# Altium schematic sheet Sheet1.SchDoc
size A3; SheetNumber: 1; SheetTotal: 1; SPICEModelCachePJYHEPLU: <root> / <DocumentId>PJYHEPLU</DocumentId> / </root>
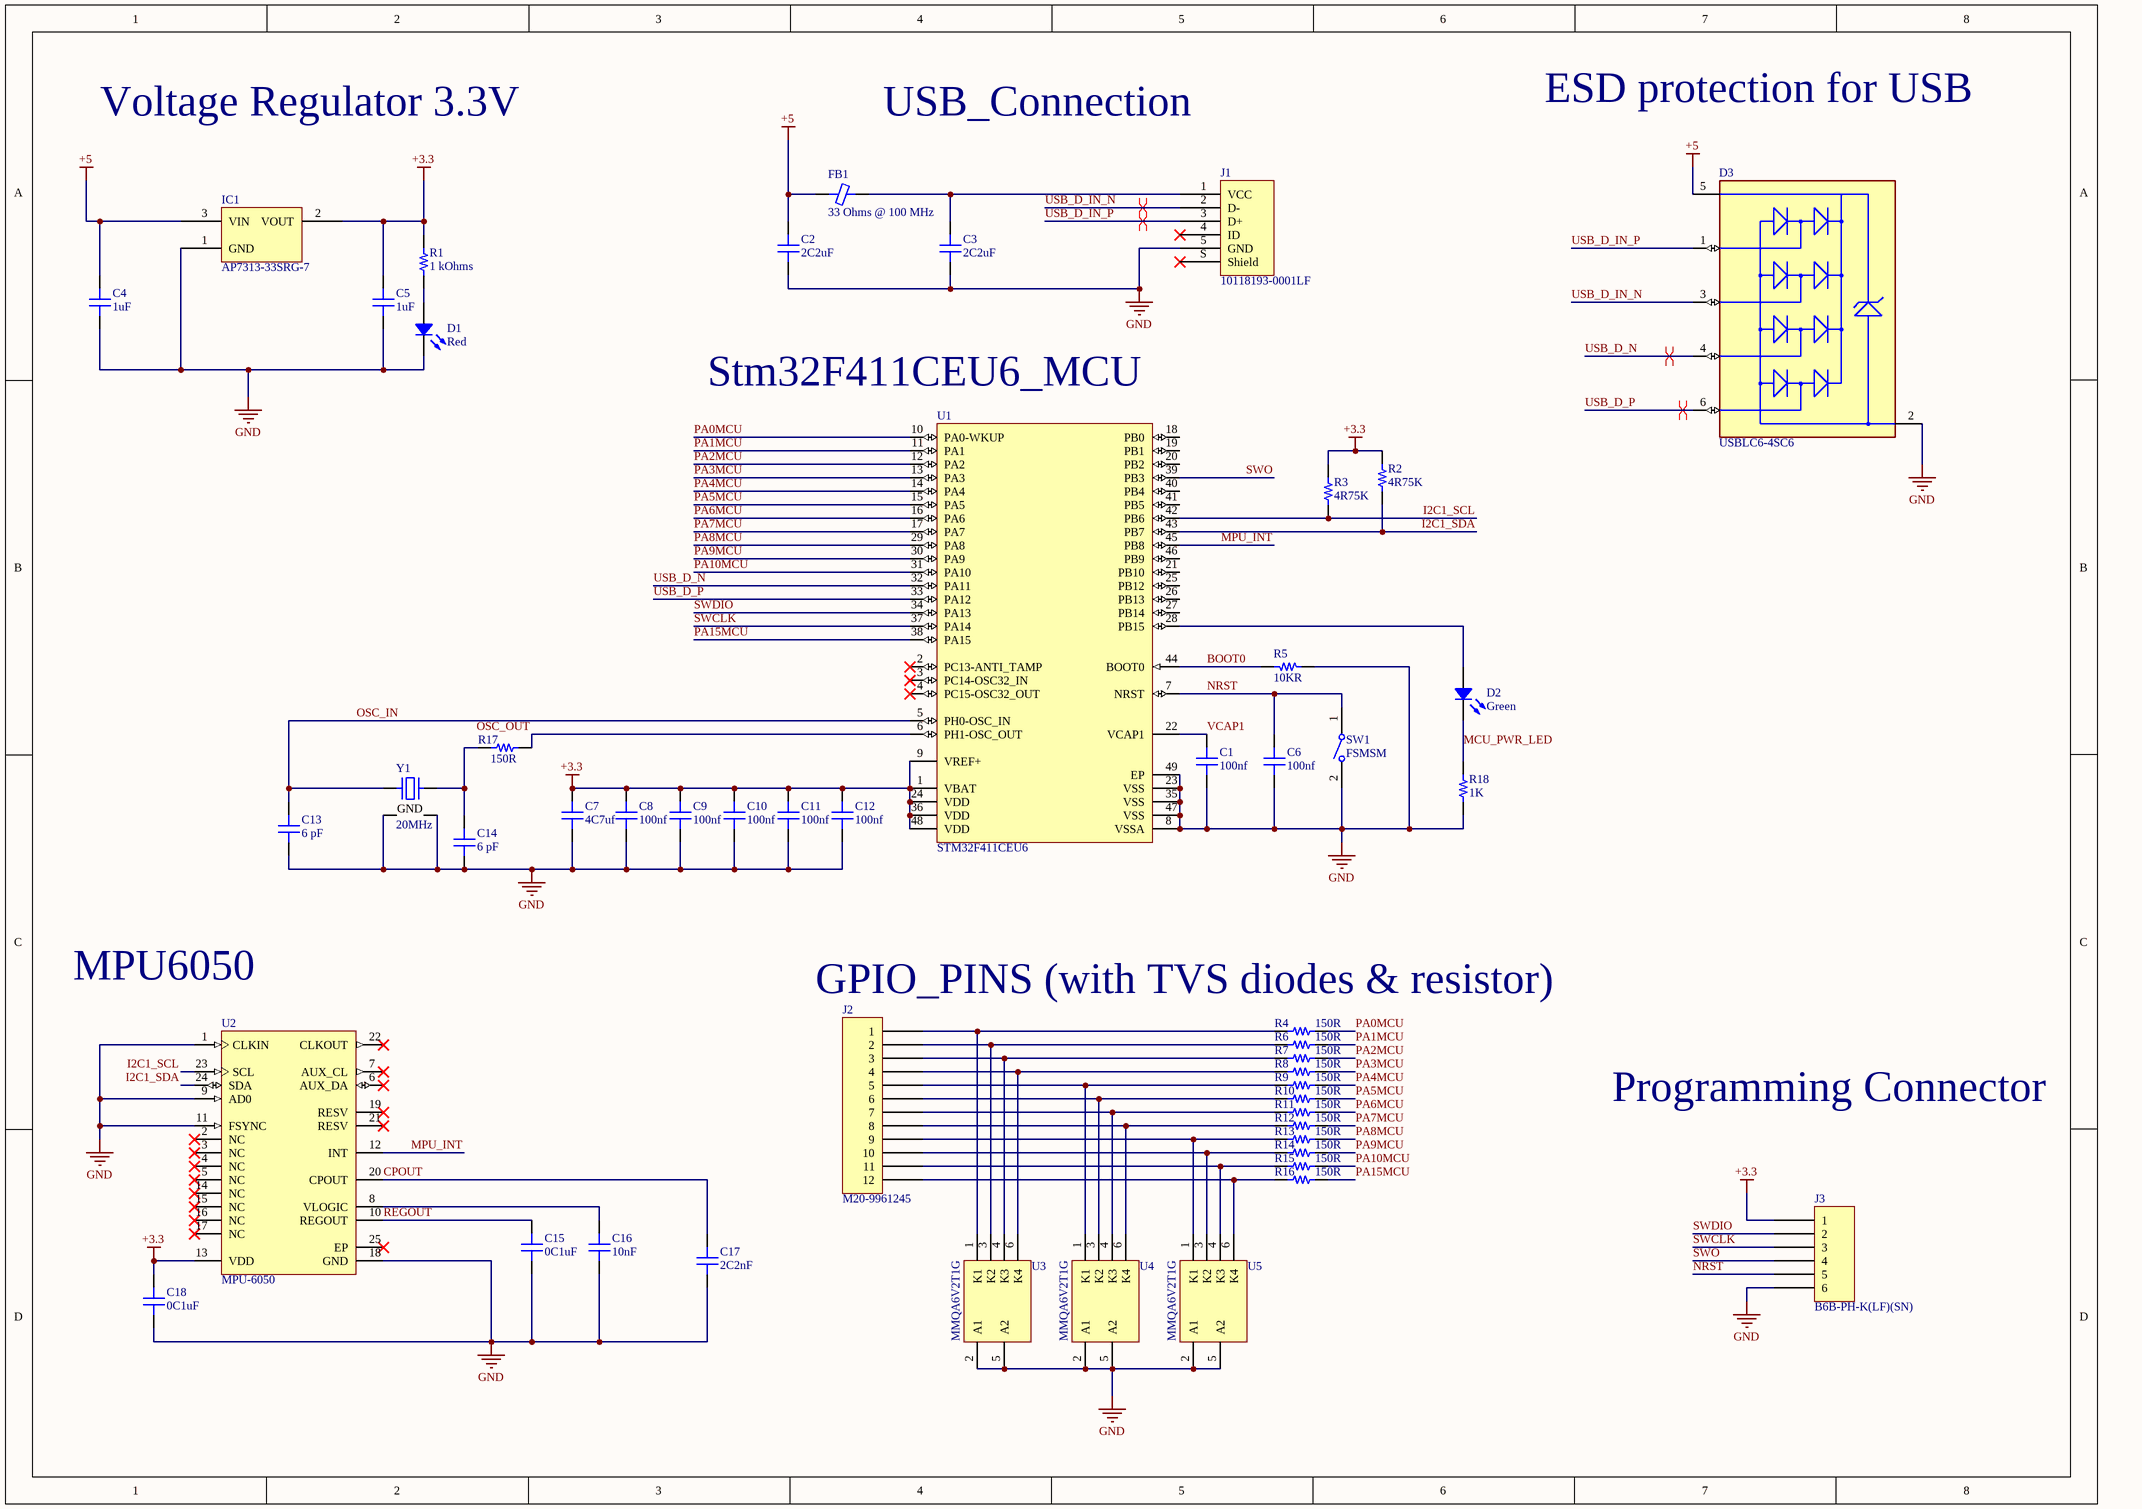
[diagram p0: Sheet1.SchDoc]

## Parts
C1  100nf  [CAP 0603_1608]
C2  2C2uF  [CAP 0805_2012]
C3  2C2uF  [CAP 0805_2012]
C4  1uF  [CAP 0805_2012]
C5  1uF  [CAP 0805_2012]
C6  100nf  [CAP 0603_1608]
C7  4C7uf  [CAP 0603_1608]
C8  100nf  [CAP 0603_1608]
C9  100nf  [CAP 0603_1608]
C10  100nf  [CAP 0603_1608]
C11  100nf  [CAP 0603_1608]
C12  100nf  [CAP 0603_1608]
C13  6 pF  [CAP 0805_2012]
C14  6 pF  [CAP 0805_2012]
C15  0C1uF  [CAP 0603_1608]
C16  10nF  [CAP 0805_2012]
C17  2C2nF  [CAP 0603_1608]
C18  0C1uF  [CAP 0603_1608]
D1  Red  [LED 0603_1608 RED]
D2  Green  [LED 0603_1608 GREEN]
D3  USBLC6-4SC6  [FP-SOT23-6L-MFG]
FB1  33 Ohms @ 100 MHz  [FER 0201_0603]
IC1  AP7313-33SRG-7  [DIODES SOT-23-3]
J1  10118193-0001LF  [FCI USB 10118193-0001LF]
J2  M20-9961245  [HARWIN M20-9961245]
J3  B6B-PH-K(LF)(SN)  [JST B6B-PH-K]
R1  1 kOhms  [RES 0805_2012]
R2  4R75K  [RES 0402_1005]
R3  4R75K  [RES 0402_1005]
R4  150R  [RES 0603_1608]
R5  10KR  [RES 0603_1608]
R6  150R  [RES 0603_1608]
R7  150R  [RES 0603_1608]
R8  150R  [RES 0603_1608]
R9  150R  [RES 0603_1608]
R10  150R  [RES 0603_1608]
R11  150R  [RES 0603_1608]
R12  150R  [RES 0603_1608]
R13  150R  [RES 0603_1608]
R14  150R  [RES 0603_1608]
R15  150R  [RES 0603_1608]
R16  150R  [RES 0603_1608]
R17  150R  [RES 0402_1005]
R18  1K  [RES 0402_1005]
SW1  FSMSM  [TECO-FSMSM-2_V]
U1  STM32F411CEU6  [STM-UFQFPN48_L]
U2  MPU-6050  [IS-QFN-24_V]
U3  MMQA6V2T1G  [ONSC-SC-74-6-318F-05_V]
U4  MMQA6V2T1G  [ONSC-SC-74-6-318F-05_V]
U5  MMQA6V2T1G  [ONSC-SC-74-6-318F-05_V]
Y1  20MHz  [KYOCERA CX2016DB]

## Nets
+3.3: C5.1 C7.1 C8.1 C9.1 C10.1 C11.1 C12.1 C18.1 IC1.2(VOUT) J3.1 R1.1 R2.1 R3.1 U1.1(VBAT) U1.9(VREF+) U1.24(VDD) U1.36(VDD) U1.48(VDD) U2.13(VDD)
+5: C2.2 C4.1 D3.5(VBUS) FB1.1 IC1.3(VIN)
GND: C1.2 C2.1 C3.1 C4.2 C5.2 C6.2 C7.2 C8.2 C9.2 C10.2 C11.2 C12.2 C13.2 C14.2 C15.2 C16.2 C17.2 C18.2 D1.2 D3.2(GND) IC1.1(GND) J1.5(GND) J3.6 R5.1 R18.2 SW1.2 U1.8(VSSA) U1.23(VSS) U1.35(VSS) U1.47(VSS) U1.49(EP) U2.1(CLKIN) U2.9(AD0) U2.11(FSYNC) U2.18(GND) U3.2(A1) U3.5(A2) U4.2(A1) U4.5(A2) U5.2(A1) U5.5(A2) Y1.2(GND) Y1.4(GND)
BOOT0: R5.2 U1.44(BOOT0)
CPOUT: C17.1 U2.20(CPOUT)
I2C1_SCL: R3.2 U1.42(PB6) U2.23(SCL)
I2C1_SDA: R2.2 U1.43(PB7) U2.24(SDA)
MCU_PWR_LED: D2.2 R18.1
MPU_INT: U1.45(PB8) U2.12(INT)
NRST: C6.1 J3.5 SW1.1 U1.7(NRST)
OSC_IN: C13.1 U1.5(PH0-OSC_IN) Y1.1
OSC_OUT: R17.2 U1.6(PH1-OSC_OUT)
PA0MCU: R4.2 U1.10(PA0-WKUP)
PA1MCU: R6.2 U1.11(PA1)
PA2MCU: R7.2 U1.12(PA2)
PA3MCU: R8.2 U1.13(PA3)
PA4MCU: R9.2 U1.14(PA4)
PA5MCU: R10.2 U1.15(PA5)
PA6MCU: R11.2 U1.16(PA6)
PA7MCU: R12.2 U1.17(PA7)
PA8MCU: R13.2 U1.29(PA8)
PA9MCU: R14.2 U1.30(PA9)
PA10MCU: R15.2 U1.31(PA10)
PA15MCU: R16.2 U1.38(PA15)
REGOUT: C15.1 U2.10(REGOUT)
SWCLK: J3.3 U1.37(PA14)
SWDIO: J3.2 U1.34(PA13)
SWO: J3.4 U1.39(PB3)
USB_D_IN_N: D3.3(I/O2) J1.2(D-)
USB_D_IN_P: D3.1(I/O1) J1.3(D+)
USB_D_N: D3.4(I/O3) U1.32(PA11)
USB_D_P: D3.6(I/O4) U1.33(PA12)
VCAP1: C1.1 U1.22(VCAP1)
NetC3_2: C3.2 FB1.2 J1.1(VCC)
NetC14_1: C14.1 R17.1 Y1.3
NetC16_1: C16.1 U2.8(VLOGIC)
NetD1_1: D1.1 R1.2
NetD2_1: D2.1 U1.28(PB15)
NetJ2_1: J2.1 R4.1 U3.1(K1)
NetJ2_2: J2.2 R6.1 U3.3(K2)
NetJ2_3: J2.3 R7.1 U3.4(K3)
NetJ2_4: J2.4 R8.1 U3.6(K4)
NetJ2_5: J2.5 R9.1 U4.1(K1)
NetJ2_6: J2.6 R10.1 U4.3(K2)
NetJ2_7: J2.7 R11.1 U4.4(K3)
NetJ2_8: J2.8 R12.1 U4.6(K4)
NetJ2_9: J2.9 R13.1 U5.1(K1)
NetJ2_10: J2.10 R14.1 U5.3(K2)
NetJ2_11: J2.11 R15.1 U5.4(K3)
NetJ2_12: J2.12 R16.1 U5.6(K4)

Not connected (* = marked no-connect by the designer): J1 4(ID)* S(Shield)*; U1 2(PC13-ANTI_TAMP)* 3(PC14-OSC32_IN)* 4(PC15-OSC32_OUT)* 18(PB0) 19(PB1) 20(PB2) 21(PB10) 25(PB12) 26(PB13) 27(PB14) 40(PB4) 41(PB5) 46(PB9); U2 2(NC)* 3(NC)* 4(NC)* 5(NC)* 6(AUX_DA)* 7(AUX_CL)* 14(NC)* 15(NC)* 16(NC)* 17(NC)* 19(RESV)* 21(RESV)* 22(CLKOUT)* 25(EP)*

## Layout directives
differential pair: USB_D_IN_N, USB_D_IN_P, USB_D_N, USB_D_P

## Notes on the sheet
- ESD protection for USB
- Voltage Regulator 3.3V
- USB_Connection
- (near U1) Stm32F411CEU6_MCU
- MPU6050
- GPIO_PINS (with TVS diodes & resistor)
- Programming Connector

## Library data of the parts
C1 C6 C8-C12 = 6R3X14W104MV4T: CAP CER 0.1UF 6.3V X7R 0603; manufacturer: Johanson Dielectrics Inc.; Capacitance: 0.1 µF; Tolerance: ±20%; Part Number: 6R3X14W104MV4T; Value: 100nf; Applications: Bypass, Decoupling; componentlink1description: Datasheet; componentlink1url: https://www.johansondielectrics.com/downloads/x2y-filter-and-decoupling-capacitors.pdf; componentlink2description: DigiKey Link; componentlink2url: https://www.digikey.com/en/products/detail/johanson-dielectrics-inc/6R3X14W104MV4T/1556331; Device Package: 0603 (1608 Metric); Features: Low ESL (X2Y); lastupdated: 2/9/2024 8:10:30 PM; Lifecycle Status: Active; Minimum Order: 1; Mounting Type: Surface Mount, MLCC; Operating Temperature: -55°C ~ 125°C; Package / Case: 0603 (1608 Metric); packaging: TapeAndReel; partid: 2650; Part Status: Active; price: 0.08; series: X2Y®; Size / Dimension: 0.064" L x 0.035" W (1.63mm x 0.89mm); Supplier 1: DigiKey; Supplier Part Number 1: 709-1009-1-ND; Temperature Coefficient: X7R; Thickness (Max): 0.026" (0.66mm); Voltage - Rated: 6.3V
C2 C3 = EMK212BJ225KGHT: CAP CER 2.2UF 16V X5R 0805; manufacturer: Taiyo Yuden; Capacitance: 2.2 µF; Tolerance: ±10%; Part Number: EMK212BJ225KGHT; Value: 2C2uF; Applications: Automotive; componentlink1description: Datasheet; componentlink1url: https://ds.yuden.co.jp/TYCOMPAS/ut/detail?pn=EMK212BJ225KGHT  &u=M; componentlink2description: DigiKey Link; componentlink2url: https://www.digikey.com/en/products/detail/taiyo-yuden/EMK212BJ225KGHT/4157459; Device Package: 0805 (2012 Metric); lastupdated: 2/9/2024 8:16:06 PM; Lifecycle Status: Active; Minimum Order: 1; Mounting Type: Surface Mount, MLCC; Operating Temperature: -55°C ~ 85°C; Package / Case: 0805 (2012 Metric); packaging: TapeAndReel; partid: 3646; Part Status: Active; price: 0.03; Ratings: AEC-Q200; series: M; Size / Dimension: 0.079" L x 0.049" W (2.00mm x 1.25mm); Supplier 1: DigiKey; Supplier Part Number 1: 587-3323-1-ND; Temperature Coefficient: X5R; Thickness (Max): 0.053" (1.35mm); Voltage - Rated: 16V
C4 C5 = C0805C105K4RECAUTO: CAP CER 0805 1UF 16V X7R 10%; manufacturer: KEMET; Capacitance: 1 µF; Part Number: C0805C105K4RECAUTO; Value: 1uF; Applications: Automotive, ESD Protection; componentlink1description: Datasheet; componentlink1url: https://connect.kemet.com:7667/gateway/IntelliData-ComponentDocumentation/1.0/download/datasheet/C0805C105K4RECAUTO; componentlink2description: DigiKey Link; componentlink2url: https://www.digikey.com/en/products/detail/kemet/C0805C105K4RECAUTO/8646678; Device Package: 0805 (2012 Metric); lastupdated: 2/9/2024 8:14:56 PM; Lifecycle Status: Active; Minimum Order: 1; Mounting Type: Surface Mount, MLCC; Operating Temperature: -55°C ~ 125°C; Package / Case: 0805 (2012 Metric); packaging: TapeAndReel; partid: 46500; Part Status: Active; price: 0.04; Ratings: AEC-Q200; series: ESD SMD Auto X7R; Size / Dimension: 0.079" L x 0.049" W (2.00mm x 1.25mm); Supplier 1: DigiKey; Supplier Part Number 1: 399-C0805C105K4RECAUTOCT-ND; Temperature Coefficient: X7R; Thickness (Max): 0.055" (1.40mm); Tolerance: ±10%; Voltage - Rated: 16V
C7 = 06036D475KAT4A: CAP CER 4.7UF 6.3V X5R 0603; manufacturer: AVX Corporation; Capacitance: 4.7µF; Tolerance: ±10%; Part Number: 06036D475KAT4A; Value: 4C7uf; Applications: General Purpose; componentlink1description: Datasheet; componentlink1url: http://datasheets.avx.com/cx5r.pdf; componentlink2description: DigiKey Link; componentlink2url: http://digikey.com/product-detail/en/avx-corporation/06036D475KAT4A/478-10813-1-ND/7536337; Device Package: 0603 (1608 Metric); lastupdated: 9/2/2020 1:03:34 AM; Lifecycle Status: Active; Minimum Order: 1; Mounting Type: Surface Mount, MLCC; Operating Temperature: -55°C ~ 85°C; Package / Case: 0603 (1608 Metric); packaging: TapeAndReel; partid: 2929; Part Status: Active; price: 0.02; series: -; Size / Dimension: 0.063" L x 0.032" W (1.60mm x 0.81mm); Supplier 1: DigiKey; Supplier Part Number 1: 478-10813-1-ND; Temperature Coefficient: X5R; Thickness (Max): 0.037" (0.94mm); Voltage - Rated: 6.3V
C13 C14 = CC0805CRNPO9BN6R0: CAP CER 6PF 50V C0G/NPO 0805; manufacturer: Yageo; Temperature Coefficient: C0G, NP0; Tolerance: ±0.25pF; Part Number: CC0805CRNPO9BN6R0; Value: 6 pF; Applications: General Purpose; Capacitance: 6 pF; componentlink1description: Datasheet; componentlink1url: https://www.yageo.com/upload/media/product/productsearch/datasheet/mlcc/UPY-GP_NP0_16V-to-50V_17.pdf; componentlink2description: DigiKey Link; componentlink2url: https://www.digikey.com/en/products/detail/yageo/CC0805CRNPO9BN6R0/5883903; Device Package: 0805 (2012 Metric); lastupdated: 2/9/2024 8:15:48 PM; Lifecycle Status: Active; Minimum Order: 1; Mounting Type: Surface Mount, MLCC; Operating Temperature: -55°C ~ 125°C; Package / Case: 0805 (2012 Metric); packaging: TapeAndReel; partid: 10689; Part Status: Active; price: 0.02; series: CC; Size / Dimension: 0.079" L x 0.049" W (2.00mm x 1.25mm); Supplier 1: DigiKey; Supplier Part Number 1: 311-4149-1-ND; Thickness (Max): 0.028" (0.70mm); Voltage - Rated: 50V
C15 C18 = C0603X104K8RAC7867: CAP CER 0.1UF 10V X7R 0603; manufacturer: KEMET; Capacitance: 0.1 µF; Tolerance: ±10%; Part Number: C0603X104K8RAC7867; Value: 0C1uF; Applications: Boardflex Sensitive; componentlink1description: Datasheet; componentlink1url: https://api.kemet.com/component-edge/download/datasheet/C0603X104K8RACTU.pdf; componentlink2description: DigiKey Link; componentlink2url: https://www.digikey.com/en/products/detail/kemet/C0603X104K8RAC7867/1842285; Device Package: 0603 (1608 Metric); Features: Soft Termination; lastupdated: 2/9/2024 8:09:53 PM; Lifecycle Status: Active; Minimum Order: 1; Mounting Type: Surface Mount, MLCC; Operating Temperature: -55°C ~ 125°C; Package / Case: 0603 (1608 Metric); packaging: TapeAndReel; partid: 39072; Part Status: Active; price: 0.07; series: SMD Comm X7R Flex; Size / Dimension: 0.063" L x 0.031" W (1.60mm x 0.80mm); Supplier 1: DigiKey; Supplier Part Number 1: 399-C0603X104K8RAC7867CT-ND; Temperature Coefficient: X7R; Thickness (Max): 0.034" (0.87mm); Voltage - Rated: 10V
C16 = 0805ZC103KAT2A: CAP CER 10000PF 10V X7R 0805; manufacturer: AVX Corporation; Tolerance: ±10%; Part Number: 0805ZC103KAT2A; Value: 10nF; Applications: General Purpose; Capacitance: 10000pF; componentlink1description: Datasheet; componentlink1url: http://datasheets.avx.com/X7RDielectric.pdf; componentlink2description: DigiKey Link; componentlink2url: http://digikey.com/product-detail/en/avx-corporation/0805ZC103KAT2A/478-11396-1-ND/8019147; Device Package: 0805 (2012 Metric); lastupdated: 9/2/2020 1:04:15 AM; Lifecycle Status: Active; Minimum Order: 1; Mounting Type: Surface Mount, MLCC; Operating Temperature: -55°C ~ 125°C; Package / Case: 0805 (2012 Metric); packaging: TapeAndReel; partid: 15514; Part Status: Active; price: 0.05; series: -; Size / Dimension: 0.079" L x 0.049" W (2.01mm x 1.25mm); Supplier 1: DigiKey; Supplier Part Number 1: 478-11396-1-ND; Temperature Coefficient: X7R; Thickness (Max): 0.037" (0.94mm); Voltage - Rated: 10V
C17 = C0603X222K5RACAUTO: CAP CER 2200PF 50V X7R 0603; manufacturer: KEMET; Tolerance: ±10%; Part Number: C0603X222K5RACAUTO; Value: 2C2nF; Applications: Automotive, Boardflex Sensitive; Capacitance: 2200 pF; componentlink1description: Datasheet; componentlink1url: https://api.kemet.com/component-edge/download/datasheet/C0603X222K5RACAUTO.pdf; componentlink2description: DigiKey Link; componentlink2url: https://www.digikey.com/en/products/detail/kemet/C0603X222K5RACAUTO/7803592; Device Package: 0603 (1608 Metric); Features: Soft Termination; lastupdated: 2/9/2024 8:10:18 PM; Lifecycle Status: Active; Minimum Order: 1; Mounting Type: Surface Mount, MLCC; Operating Temperature: -55°C ~ 125°C; Package / Case: 0603 (1608 Metric); packaging: TapeAndReel; partid: 11380; Part Status: Active; price: 0.06; Ratings: AEC-Q200; series: SMD Auto X7R Flex; Size / Dimension: 0.063" L x 0.031" W (1.60mm x 0.80mm); Supplier 1: DigiKey; Supplier Part Number 1: 399-16489-1-ND; Temperature Coefficient: X7R; Thickness (Max): 0.037" (0.95mm); Voltage - Rated: 50V
D1 = 150060RS86000: WL-SMCW SMT MONO-COLOR CHIP LED; Manufacturer: Würth Elektronik; Current - Test: 20mA; Lens Color: Colorless; Lens Size: 0.70mm Dia; Lens Style: Round with Domed Top; Lens Transparency: Clear; Millicandela Rating: 800mcd; Viewing Angle: 40°; Voltage - Forward (Vf) (Typ): 2V; Wavelength - Dominant: 624nm; Wavelength - Peak: 632nm; Part Number: 150060RS86000; Color: Red; ComponentLink1Description: Datasheet; ComponentLink1URL: https://www.we-online.com/catalog/datasheet/150060RS86000.pdf; ComponentLink2Description: DigiKey Link; ComponentLink2URL: https://www.digikey.com/en/products/detail/würth-elektronik/150060RS86000/12371435; Device Package: 0603 (1608 Metric); Height (Max): 1.05mm; LastUpdated: 3/11/2024 7:52:02 AM; Lifecycle Status: Active; Minimum Order: 1; Mounting Type: Surface Mount; Package / Case: 0603 (1608 Metric); Packaging: TapeAndReel; PartId: 1069; Part Status: Active; Price: 0.23; Series: WL-SMCW; Size / Dimension: 1.60mm L x 0.80mm W; Supplier 1: DigiKey; Supplier Part Number 1: 732-150060RS86000CT-ND; Supplier Device Package: 0603; Value: Red
D2 = 150060VS75020: WL-SMCW SMT MONO-COLOR CHIP LED; Manufacturer: Würth Elektronik; Configuration: Independent; Current - Test: 20mA; Lens Color: Colorless; Lens Size: 1.10mm x 0.80mm; Lens Style: Rectangle with Flat Top; Lens Transparency: Clear; Millicandela Rating: 50mcd; Viewing Angle: 140°; Voltage - Forward (Vf) (Typ): 2V; Wavelength - Dominant: 570nm; Wavelength - Peak: 572nm; Part Number: 150060VS75020; Color: Green; ComponentLink2Description: DigiKey Link; ComponentLink2URL: https://www.digikey.com/en/products/detail/würth-elektronik/150060VS75020/10468264; Device Package: 0603 (1608 Metric); Height (Max): 0.45mm; LastUpdated: 3/11/2024 7:51:11 AM; Lifecycle Status: Active; Minimum Order: 1; Mounting Type: Surface Mount; Package / Case: 0603 (1608 Metric); Packaging: TapeAndReel; PartId: 588; Part Status: Active; Price: 0.19; Series: WL-SMCW; Size / Dimension: 1.60mm L x 0.80mm W; Supplier 1: DigiKey; Supplier Part Number 1: 732-150060VS75020CT-ND; Supplier Device Package: 0603; Value: Green
D3 = CMP-2000-07370-2: TVS DIODE 5.25V 17V SOT23-6; Manufacturer: STMicroelectronics; Peak Pulse Power: 130W; Breakdown Voltage: 6V; Value: 3pF; Direction: Unidirectional; Interface: USB,Ethernet,Other; Number Of Channels: 4; Standoff Height: 0mm; Max Junction Temp: +125°C; Digikey Description: TVS DIODE 5.25V 17V SOT23-6; Automotive: No; Package: SOT23-6L; Mouser Description: USBLC6 Series 4 Line 6 V Uni / Bi-Directional ESD Protection - SOT-23-6; Octopart: https://octopart.com/usblc6-4sc6-stmicroelectronics-347147; RoHS: TRUE; ComponentLink2URL: https://upverter.com/datasheet/23dc4ffb028d868909e80577610284b194f13213.pdf; ComponentLink2Description: Datasheet; Device Class L1: Circuit Protection; Lead Free: Yes; Temperature Range High: +125°C; Device Class L2: ESD and Circuit Protection ICs; Device Class L3: unset; Capacitance: 3pF; Height: 1.45mm; Temperature Range Low: -40°C; Manufacturer Part Number: USBLC6-4SC6; Temperature: -40°C to +125°C; Category: Diode; Clamping Voltage: 17V
FB1 = MMZ0603F330CT000: FERRITE BEAD 33 OHM 0201 1LN; Manufacturer: TDK Corporation; Current Rating (Max): 150mA; DC Resistance (DCR) (Max): 1.3Ohm; Filter Type: Signal Line; Number of Lines: 1; Part Number: MMZ0603F330CT000; ComponentLink1Description: Datasheet; ComponentLink1URL: https://product.tdk.com/info/en/catalog/datasheets/beads_commercial_signal_mmz0603_en.pdf?ref_disty=digikey; ComponentLink2Description: DigiKey Link; ComponentLink2URL: https://www.digikey.com/en/products/detail/tdk-corporation/MMZ0603F330CT000/2747662; Device Package: 0201 (0603 Metric); Height (Max): 0.013" (0.33mm); Impedance @ Frequency: 33 Ohms @ 100 MHz; LastUpdated: 3/11/2024 7:42:01 AM; Lifecycle Status: Active; Minimum Order: 1; Mounting Type: Surface Mount; Operating Temperature: -55°C ~ 125°C; Package / Case: 0201 (0603 Metric); Packaging: TapeAndReel; PartId: 1; Part Status: Active; Price: 0.03; Series: MMZ; Size / Dimension: 0.024" L x 0.012" W (0.60mm x 0.30mm); Supplier 1: DigiKey; Supplier Part Number 1: 445-7792-1-ND; Value: 33 Ohms @ 100 MHz
IC1 = AP7313-33SRG-7: IC REG LIN 3.3V 150MA SOT23R-3; Manufacturer: Diodes Incorporated; Current - Quiescent (Iq): 75 µA; Current - Supply (Max): 85 µA; Number of Regulators: 1; Output Configuration: Positive; Output Type: Fixed; Protection Features: Over Current, Over Temperature, Short Circuit; PSRR: 65dB (100Hz); Voltage Dropout (Max): 0.3V @ 150mA; Voltage - Input (Max): 6V; Part Number: AP7313-33SRG-7; ComponentLink1Description: Datasheet; ComponentLink1URL: https://www.diodes.com/assets/Datasheets/AP7313.pdf; ComponentLink2Description: DigiKey Link; ComponentLink2URL: https://www.digikey.com/en/products/detail/diodes-incorporated/AP7313-33SRG-7/2270807; Current - Output: 150mA; LastUpdated: 3/11/2024 8:03:47 AM; Lifecycle Status: Active; Minimum Order: 1; Mounting Type: Surface Mount; Operating Temperature: -40°C ~ 85°C; Package / Case: TO-236-3, SC-59, SOT-23-3; Packaging: TapeAndReel; Part Status: Active; Price: 0.08; Series: -; Supplier 1: DigiKey; Supplier Part Number 1: AP7313-33SRG-7DICT-ND; Supplier Device Package: SOT23R; Voltage - Output (Min/Fixed): 3.3V; Supplier: Mouser; Supplier Part Number: 511-STM32F411CEU6
J1 = 10118193-0001LF: CONN RCPT USB2.0 MICRO B SMD R/A; Manufacturer: Amphenol ICC (FCI); Connector Type: USB - micro B; Current Rating (Amps): 1.8A per Contact; Gender: Receptacle; Mating Cycles: 10000; Number of Contacts: 5; Number of Ports: 1; Shielding: Shielded; Voltage - Rated: 100VAC; Part Number: 10118193-0001LF; ComponentLink1Description: Datasheet; ComponentLink1URL: https://cdn.amphenol-icc.com/media/wysiwyg/files/documentation/datasheet/inputoutput/io_usb_micro.pdf; ComponentLink2Description: DigiKey Link; ComponentLink2URL: //digikey.com/product-detail/en/amphenol-icc-fci/10118193-0001LF/609-4616-2-ND/2785388; Features: Solder Retention; LastUpdated: 12/9/2019 8:51:28 PM; Lifecycle Status: 0; Minimum Order: 1; Mounting Feature: Horizontal; Mounting Type: Surface Mount, Right Angle; Through Hole; Operating Temperature: -30°C ~ 80°C; Packaging: TapeAndReel; Part Status: Active; Price: 0.21; Series: -; Specifications: USB 2.0; Supplier 1: DigiKey; Supplier Part Number 1: 609-4616-2-ND; Termination: Solder
J2 = M20-9961245: CONN HEADER R/A 12POS 2.54MM; Manufacturer: Harwin Inc.; Connector Type: Header, Cuttable; Contact Length - Mating: 0.240" (6.10mm); Contact Length - Post: 0.118" (3.00mm); Current Rating (Amps): 3A per Contact; Material Flammability Rating: UL94 V-0; Number of Positions: 12; Number of Positions Loaded: All; Pitch - Mating: 0.100" (2.54mm); Row Spacing - Mating: -40°C ~ 105°C; Shrouding: Unshrouded; Style: Board to Board or Cable; Part Number: M20-9961245; ComponentLink1Description: Datasheet; ComponentLink1URL: https://cdn.harwin.com/pdfs/Harwin_PC_Connectors_M20.pdf; ComponentLink2Description: DigiKey Link; ComponentLink2URL: https://www.digikey.com/en/products/detail/harwin-inc/M20-9961245/3921062; Contact Finish - Mating: Gold; Contact Material: Brass; Contact Shape: Square; Contact Type: Male Pin; Fastening Type: Push-Pull; Insulation Color: Black; Insulation Height: 0.100" (2.54mm); Insulation Material: Polyamide (PA6T), Nylon 6T; LastUpdated: 9/21/2022 7:24:59 PM; Lifecycle Status: Active; Minimum Order: 1; Mounting Type: Through Hole, Right Angle; Number of Rows: 1; Operating Temperature: -40°C ~ 105°C; Packaging: Bulk; PartId: 173; Part Status: Active; Price: 0.31; Series: M20; Supplier 1: DigiKey; Supplier Part Number 1: 952-3288-ND; Termination: Solder
J3 = B6B-PH-K(LF)(SN): CONN HEADER VERT 6POS 2MM; Manufacturer: JST Sales America Inc.; Contact Length - Mating: 0.130" (3.30mm); Contact Length - Post: 0.134" (3.40mm); Current Rating (Amps): 2A; Material Flammability Rating: UL94 V-0; Number of Positions: 6; Number of Positions Loaded: All; Overall Contact Length: 0.333" (8.45mm); Pitch - Mating: 0.079" (2.00mm); Shrouding: Shrouded - 4 Wall; Style: Board to Cable/Wire; Voltage Rating: 100V; Part Number: B6B-PH-K(LF)(SN); ComponentLink1Description: Datasheet; ComponentLink1URL: http://www.jst-mfg.com/product/pdf/eng/ePH.pdf; ComponentLink2Description: DigiKey Link; ComponentLink2URL: http://digikey.com/product-detail/en/jst-sales-america-inc/B6B-PH-K-LF-SN/455-2923-ND/2741628; Connector Type: Header; Contact Finish - Mating: Tin; Contact Finish - Post: Tin; Contact Material: Brass; Contact Shape: Square; Contact Type: Male Pin; Fastening Type: Detent Lock; Insulation Color: Ivory; Insulation Height: 0.236" (6.00mm); Insulation Material: Polyamide (PA66), Nylon 6/6; LastUpdated: 1/12/2020 10:30:17 PM; Lifecycle Status: Active; Minimum Order: 1; Mounting Type: Through Hole; Number of Rows: 1; Operating Temperature: -25°C ~ 85°C; Packaging: Bulk; PartId: 29; Part Status: Active; Price: 0.34; Series: PH; Supplier 1: DigiKey; Supplier Part Number 1: 455-2923-ND; Termination: Press-Fit, Solder
R1 = 3430A2F1K0TDF: 3430 A2 1% 1K0 100PPM 1K RL; Manufacturer: TE Connectivity Passive Product; Power (Watts): 1W; Temperature Coefficient: ±100ppm/°C; Part Number: 3430A2F1K0TDF; Value: 1 kOhms; ComponentLink2Description: DigiKey Link; ComponentLink2URL: https://www.digikey.com/en/products/detail/te-connectivity-passive-product/3430A2F1K0TDF/17764297; Composition: Thick Film; Device Package: 0805 (2012 Metric); Features: Automotive AEC-Q200; Height - Seated (Max): 0.026" (0.65mm); LastUpdated: 2/8/2024 9:00:04 PM; Lifecycle Status: Active; Minimum Order: 1; Number of Terminations: 2; Operating Temperature: -55°C ~ 155°C; Package / Case: 0805 (2012 Metric); Packaging: TapeAndReel; PartId: 77520; Part Status: Active; Price: 0.02; Ratings: AEC-Q200; Resistance: 1 kOhms; Series: 3430; Size / Dimension: 0.049" L x 0.079" W (1.25mm x 2.00mm); Supplier 1: DigiKey; Supplier Part Number 1: 1712-3430A2F1K0TDFCT-ND; Supplier Device Package: 0508; Tolerance: ±1%
R2 R3 = RQ73C1E4K75BTD: RES 4.75 KOHMS 0.1% 1/16W 0402; Manufacturer: TE Connectivity Passive Product; Power (Watts): 0.063W, 1/16W; Temperature Coefficient: ±10ppm/°C; Part Number: RQ73C1E4K75BTD; Value: 4R75K; ComponentLink1Description: Datasheet; ComponentLink1URL: //media.digikey.com/pdf/Data%20Sheets/Tyco%20Electronics%20P%20B%20PDFs/RQ73-0618%20v2.pdf; ComponentLink2Description: DigiKey Link; ComponentLink2URL: https://www.digikey.com/en/products/detail/te-connectivity-passive-product/RQ73C1E4K75BTD/9479739; Composition: Thin Film; Device Package: 0402 (1005 Metric); Features: Anti-Sulfur, Automotive AEC-Q200; Height - Seated (Max): 0.016" (0.40mm); LastUpdated: 2/9/2024 8:30:17 PM; Lifecycle Status: Active; Minimum Order: 1; Number of Terminations: 2; Operating Temperature: -55°C ~ 155°C; Package / Case: 0402 (1005 Metric); Packaging: TapeAndReel; PartId: 4266; Part Status: Active; Price: 0.27; Ratings: AEC-Q200; Resistance: 4.75 kOhms; Series: RQ73; Size / Dimension: 0.039" L x 0.020" W (1.00mm x 0.50mm); Supplier 1: DigiKey; Supplier Part Number 1: A139791CT-ND; Supplier Device Package: 0402; Tolerance: ±0.1%
R4 R6-R16 = RA73F1J150RBTD: RA73F 1J 150R 0.1% 5K RL; Manufacturer: TE Connectivity Passive Product; Power (Watts): 0.5W, 1/2W; Resistance: 150 Ohms; Temperature Coefficient: 25ppm/°C; Part Number: RA73F1J150RBTD; Value: 150R; ComponentLink1Description: Datasheet; ComponentLink1URL: https://www.te.com/commerce/DocumentDelivery/DDEController?Action=srchrtrv&DocNm=1773270-3&DocType=DS&DocLang=English; ComponentLink2Description: DigiKey Link; ComponentLink2URL: https://www.digikey.com/en/products/detail/te-connectivity-passive-product/RA73F1J150RBTD/16030954; Composition: Thin Film; Device Package: 0603 (1608 Metric); Height - Seated (Max): 0.023" (0.58mm); LastUpdated: 2/9/2024 8:40:58 PM; Lifecycle Status: Active; Minimum Order: 1; Number of Terminations: 2; Operating Temperature: -55°C ~ 155°C; Package / Case: 0603 (1608 Metric); Packaging: TapeAndReel; PartId: 71668; Part Status: Active; Price: 0.36; Series: RA73; Size / Dimension: 0.061" L x 0.031" W (1.55mm x 0.80mm); Supplier 1: DigiKey; Supplier Part Number 1: 1712-RA73F1J150RBTDCT-ND; Supplier Device Package: 0603; Tolerance: ±0.1%
R5 = SG73G1JTTD1002D: RES 10K OHM 0.5% 1/3W 0603; Manufacturer: KOA Speer Electronics, Inc.; Power (Watts): 0.333W, 1/3W; Resistance: 10 kOhms; Temperature Coefficient: ±50ppm/°C; Part Number: SG73G1JTTD1002D; Value: 10KR; ComponentLink1Description: Datasheet; ComponentLink1URL: https://www.koaspeer.com/pdfs/SG73G.pdf; ComponentLink2Description: DigiKey Link; ComponentLink2URL: https://www.digikey.com/en/products/detail/koa-speer-electronics-inc/SG73G1JTTD1002D/16825550; Composition: Thick Film; Device Package: 0603 (1608 Metric); Features: Automotive AEC-Q200, Moisture Resistant, Pulse Withstanding; Height - Seated (Max): 0.022" (0.55mm); LastUpdated: 2/9/2024 8:40:53 PM; Lifecycle Status: Active; Minimum Order: 1; Number of Terminations: 2; Operating Temperature: -55°C ~ 155°C; Package / Case: 0603 (1608 Metric); Packaging: TapeAndReel; PartId: 70977; Part Status: Active; Price: 0.04; Ratings: AEC-Q200; Series: SG73G; Size / Dimension: 0.063" L x 0.031" W (1.60mm x 0.80mm); Supplier 1: DigiKey; Supplier Part Number 1: 2019-SG73G1JTTD1002DCT-ND; Supplier Device Package: 0603; Tolerance: ±0.5%
R17 = ERJ-PA2F1500X: RES 150 OHM 1% 1/4W 0402; Manufacturer: Panasonic Electronic Components; Power (Watts): 0.25W, 1/4W; Resistance: 150 Ohms; Temperature Coefficient: ±100ppm/°C; Part Number: ERJ-PA2F1500X; Value: 150R; ComponentLink1Description: Datasheet; ComponentLink1URL: https://industrial.panasonic.com/cdbs/www-data/pdf/RDO0000/AOA0000C331.pdf; ComponentLink2Description: DigiKey Link; ComponentLink2URL: https://www.digikey.com/en/products/detail/panasonic-electronic-components/ERJ-PA2F1500X/5402645; Composition: Thick Film; Device Package: 0402 (1005 Metric); Features: Automotive AEC-Q200, Pulse Withstanding; Height - Seated (Max): 0.016" (0.40mm); LastUpdated: 2/9/2024 8:30:02 PM; Lifecycle Status: Active; Minimum Order: 1; Number of Terminations: 2; Operating Temperature: -55°C ~ 155°C; Package / Case: 0402 (1005 Metric); Packaging: TapeAndReel; PartId: 7858; Part Status: Active; Price: 0.02; Ratings: AEC-Q200; Series: ERJ-PA2; Size / Dimension: 0.039" L x 0.020" W (1.00mm x 0.50mm); Supplier 1: DigiKey; Supplier Part Number 1: P17219CT-ND; Supplier Device Package: 0402; Tolerance: ±1%
R18 = ERJ-U02D1001X: 0402 ANTI-SULFUR RES. , 0.5%, 1K; Manufacturer: Panasonic Electronic Components; Power (Watts): 0.1W, 1/10W; Resistance: 1 kOhms; Temperature Coefficient: ±200ppm/°C; Part Number: ERJ-U02D1001X; Value: 1K; ComponentLink1Description: Datasheet; ComponentLink1URL: https://industrial.panasonic.com/cdbs/www-data/pdf/RDP0000/AOA0000C334.pdf; ComponentLink2Description: DigiKey Link; ComponentLink2URL: https://www.digikey.com/en/products/detail/panasonic-electronic-components/ERJ-U02D1001X/9365326; Composition: Thick Film; Device Package: 0402 (1005 Metric); Features: Anti-Sulfur, Automotive AEC-Q200; Height - Seated (Max): 0.016" (0.40mm); LastUpdated: 2/9/2024 8:28:26 PM; Lifecycle Status: Active; Minimum Order: 1; Number of Terminations: 2; Operating Temperature: -55°C ~ 155°C; Package / Case: 0402 (1005 Metric); Packaging: TapeAndReel; PartId: 81776; Price: 0.01; Ratings: AEC-Q200; Series: ERJ-U02; Size / Dimension: 0.039" L x 0.020" W (1.00mm x 0.50mm); Supplier 1: DigiKey; Supplier Part Number 1: 10-ERJ-U02D1001XCT-ND; Supplier Device Package: 0402; Tolerance: ±0.5%
SW1 = CMP-2000-07511-1: FSMSM Push Button Switch, 50 mA, -35 to 85 degC, 2-Pin SMD, RoHS, Bulk; Manufacturer: TE Connectivity; Actuator Length: 1.07mm; Electrical Life: 20000Cycles; Actuator Material: Polyamide; Current Rating: 50mA; Illumination Type: Illuminated; Voltage Rating (DC): 24V; Contact Resistance: 100mOhm; Case\/Package: SMD/SMT; Operating Force: 180gf; Switch Travel: 0.25mm; Max Voltage Rating (DC): 12V; Throw Configuration: SPST; Packaging: LoosePiece; Max Operating Temperature: 85degC; ELV: Compliant; Package Description: 2-Pin Surface Mount Device, Body 6 x 3.5 mm, Pitch 9.19 mm; RoHSCompliant: true; Manufacturer URL: http://www.te.com/; Contact Plating: Silver; Contact Material: Brass; Mounting Technology: SurfaceMount; Contact Current Rating: 50mA; Datasheet Version: Rev. C2, 08/2014; Datasheet URL: http://www.te.com/commerce/DocumentDelivery/DDEController?Action=showdoc&DocId=Customer+Drawing%7F1437566-3%7FC2%7Fpdf%7FEnglish%7FENG_CD_1437566-3_C2_1437566_3_1_c.dwg.pdf%7F1437566-3; Mechanical Life: 20000Cycles; Package Reference: FSMSM; REACH SVHC: Unknown; Orientation: Straight; Min Operating Temperature: -35degC; Lead Free: LeadFree; Termination: GullWing; Package Quantity: 1000; Mount: SurfaceMount
U1 = CMP-0243-00165-1: ARM Cortex-M4 32-bit MCU+FPU, 512 KB Flash, 128 KB RAM, 36 I/Os, 48-Pin UFQFPN, -40 to 85 degC, Tray; Operating Frequency(F) (Processor speed) (MHz): 100; FLASH Size (Prog) (kB): 512; Internal RAM Size (kB): 128; I/Os (High Current): 36; Supply Voltage(Vcc) min (V): 1.7; Package Reference: 48-Pin Ultra Thin Fine Pitch Quad Flat No-Lead, 7 x 7 x 0.6 mm Body, 0.5 mm Pitch, Exposed Pad; ComponentLink1Description: Manufacturer URL; ComponentLink1URL: http://www.st.com/; Packing: Tray; Package Description: UFQFPN48; Core: ARM Cortex-M4; ComponentLink2Description: Datasheet; ComponentLink2URL: http://www.st.com/st-web-ui/static/active/en/resource/technical/document/datasheet/DM00115249.pdf; DatasheetVersion: Rev. 6; Mounting Technology: Surface Mount
U2 = CMP-1753-00002-2: 3-Axis Gyroscope, Accelerometer and a Digital Motion Processor(TM) (DMP), 2.375 to 3.46 V, -40 to 85 degC, 24-Pin QFN, RoHS, Tape and Reel; Manufacturer: InvenSense; Featured Product: MPU-60506-Axis,IntegratedI²CSolution; Other Names: 1428-1007-2 / MPU6050; Sensor Type: MotionTracking; Online Catalog: MPU-6000™Series; Unit PriceUSD: Digital; Datasheet Version: Rev. 3.3, 05/2012; Category: Sensors,Transducers; Datasheet URL: http://datasheet.octopart.com/MPU-6050-InvenSense-datasheet-14421344.pdf; Family: Multifunction; Standard Package: 5,000; Manufacturer URL: http://www.invensense.com/; Output Type: Digital; Dynamic Catalog: MPU-6000™Series
U3-U5 = CMP-1061-00170-1: Quad Monolithic Common Anode, Transient Voltage Suppressor for ESD Protection, 6-Pin SC-74, Pb-Free, Tape and Reel; Manufacturer: On Semiconductor; V(BR) Typ (V): 6.2; IR Max (uA): 0.7; Direction: Unidirectional; PackageReference: SC-74-6-318F-05; PartNumber: MMQA6V2T1G; Packing: Tape and Reel; Mounting Technology: Surface Mount; PackageVersion: Rev. N, 06/2012; DatasheetVersion: Rev. 10; ComponentLink3URL: http://www.onsemi.com/pub_link/Collateral/318F-05.PDF; ComponentLink3Description: Package Specification; ComponentLink2Description: Datasheet; PackageDescription: 6-Pin Small Outline Transistor, Body 3 x 1.5 mm, Pitch 0.95 mm; ComponentLink1URL: http://www.onsemi.com/; RoHS: Pb-Free; ComponentLink2URL: http://www.onsemi.com/pub_link/Collateral/MMQA-D.PDF; ComponentLink1Description: Manufacturer URL
Y1 = CX2016DB20000D0FLJCC: CRYSTAL 20.0000MHZ 8PF SMD; Manufacturer: Kyocera International Inc. Electronic Components; ESR (Equivalent Series Resistance): 150 Ohms; Frequency Stability: ±15ppm; Frequency Tolerance: ±10ppm; Operating Mode: Fundamental; Part Number: CX2016DB20000D0FLJCC; ComponentLink1Description: Datasheet; ComponentLink1URL: //media.digikey.com/pdf/Data%20Sheets/Optrex%20PDFs/CX2016DB_Series_Spec.pdf; ComponentLink2Description: DigiKey Link; ComponentLink2URL: http://digikey.com/product-detail/en/kyocera-international-inc-electronic-components/CX2016DB20000D0FLJCC/1253-1349-1-ND/4896439; Frequency: 20MHz; Height - Seated (Max): 0.018" (0.45mm); LastUpdated: 3/11/2024 7:54:31 AM; Lifecycle Status: Active; Load Capacitance: 8pF; Minimum Order: 1; Mounting Type: Surface Mount; Operating Temperature: -30°C ~ 85°C; Package / Case: 4-SMD, No Lead; Packaging: TapeAndReel; PartId: 474; Part Status: Active; Price: 0.48; Series: CX2016DB, Kyocera; Size / Dimension: 0.079" L x 0.063" W (2.00mm x 1.60mm); Supplier 1: DigiKey; Supplier Part Number 1: 1253-1349-1-ND; Type: MHz Crystal; Value: 20MHz